# EAGLE design S7G2_Titan_Teknic_motor_sim (EAGLE 9.6.2)
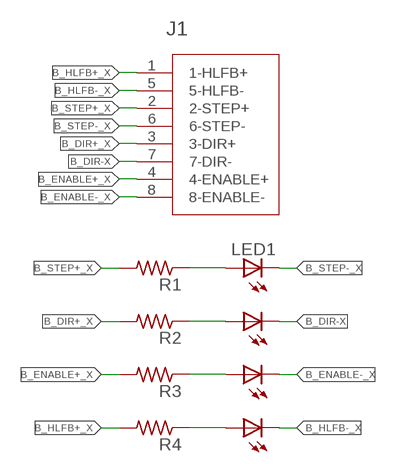
[diagram p0: schematic, sheet 1]

## Parts
J1  TEKNIC_MOTOR_SD_8PIN  [CON_39281083]
LED1  Green  LED_0805_GREEN  [0805]
LED2  Green  LED_0805_GREEN  [0805]
LED3  Green  LED_0805_GREEN  [0805]
LED4  Green  LED_0805_GREEN  [0805]
R1  R_0805  [0805]
R2  R_0805  [0805]
R3  R_0805  [0805]
R4  R_0805  [0805]

## Nets
B_DIR+_X: J1.3(3-DIR+) R2.2
B_DIR-X: J1.7(7-DIR-) LED2.2(C)
B_ENABLE+_X: J1.4(4-ENABLE+) R3.2
B_ENABLE-_X: J1.8(8-ENABLE-) LED3.2(C)
B_HLFB+_X: J1.1(1-HLFB+) R4.2
B_HLFB-_X: J1.5(5-HLFB-) LED4.2(C)
B_STEP+_X: J1.2(2-STEP+) R1.2
B_STEP-_X: J1.6(6-STEP-) LED1.2(C)
N$1: LED1.1(A) R1.1
N$2: LED2.1(A) R2.1
N$3: LED3.1(A) R3.1
N$4: LED4.1(A) R4.1

## Library data of the parts
J1 = 3D_MIG_Controller:TEKNIC_MOTOR_SD_8PIN; COPYRIGHT: Copyright (C) 2022 Ultra Librarian. All rights reserved.; MANUFACTURER_PART_NUMBER: 39281083; MFR_NAME: Molex Connector Corporation
LED1-LED4 = 3D_MIG_Controller:LED_0805_GREEN: Green 570nm LED Indication - Discrete 2.2V 0805 (2012 Metric); PARTNO: LG R971-KN-1
R1-R4 = 3D_MIG_Controller:R_0805

## Board
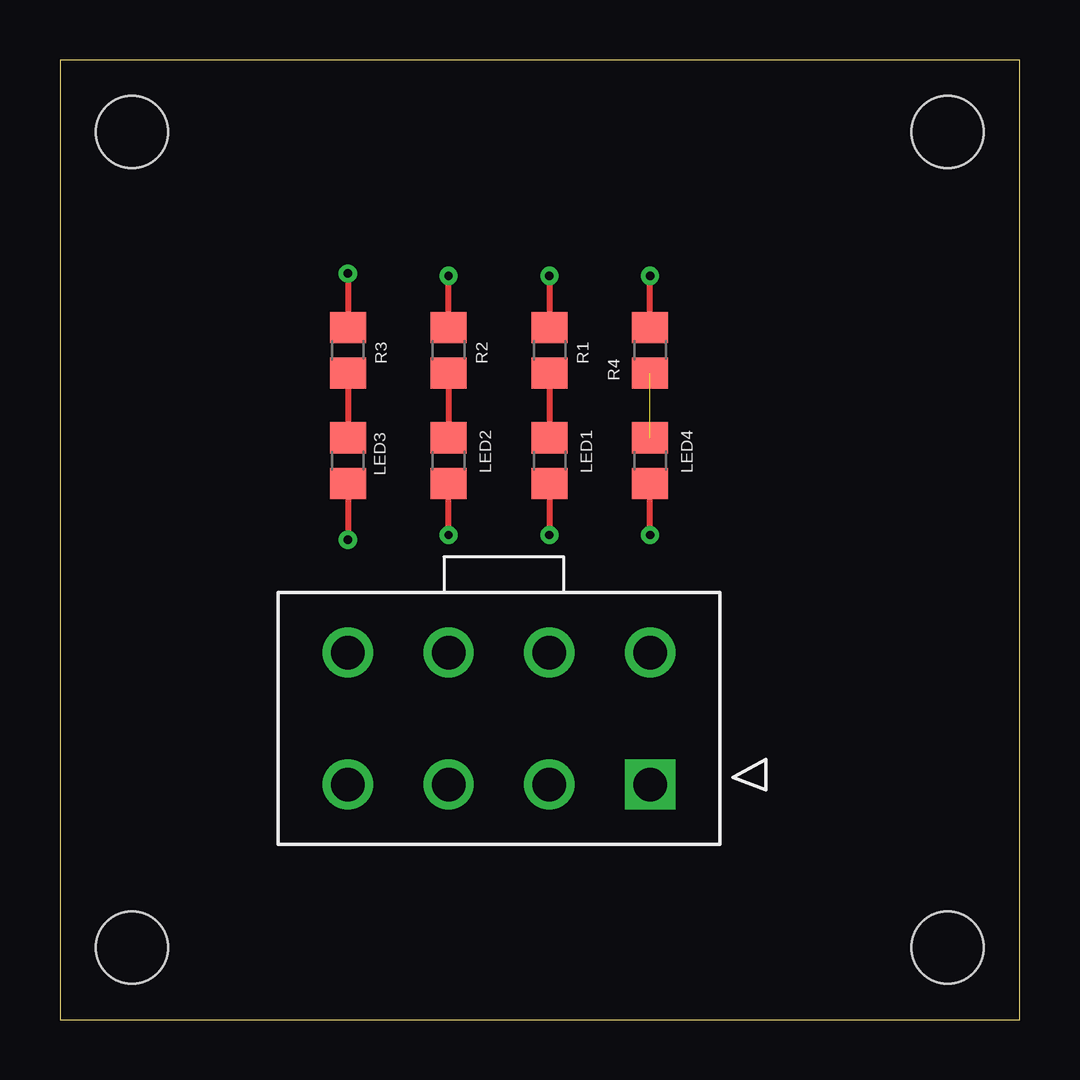
[diagram p1: board, top side]
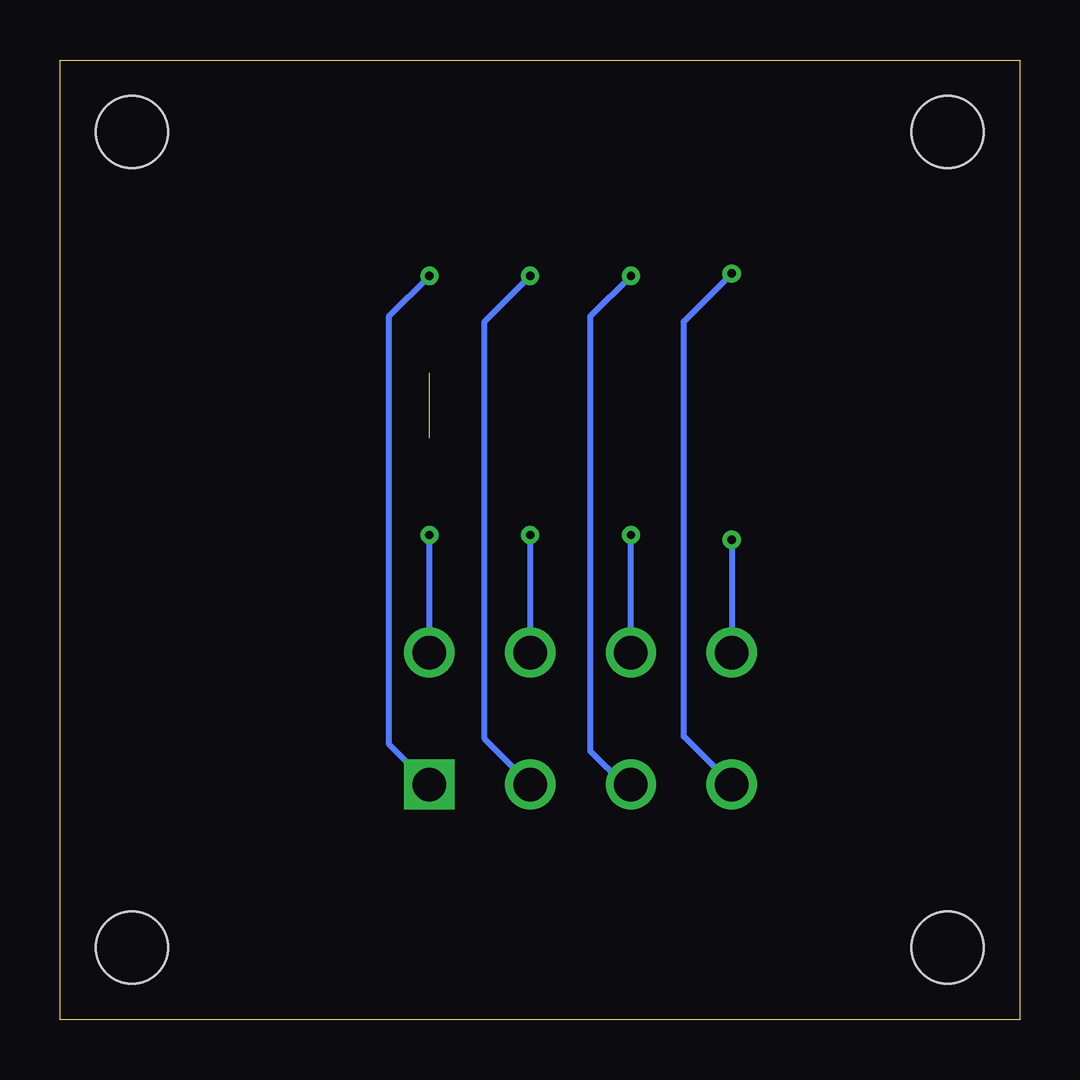
[diagram p2: board, bottom side, seen from below]

Size 40 x 40 mm. Coordinates in mm from the lower left corner, seen from the top.
Outline: 0,0 40,0 40,40 0,40 0,0
Copper layers (1*16): Top 0.035mm / dielectric 1.5mm / Bottom 0.035mm
Design rules "default": minimum track width 6mil, minimum drill 0.35mm, track to track 6mil, track to pad 6mil, pad to pad 6mil, via to via 6mil, smd to smd 6mil, copper to edge 40mil, drill to drill 6mil, minimum pad ring 10mil, minimum via ring 8mil, stop-mask expansion 4mil, vias tented up to drill 0mil, thermal gap 10mil
Holes 3 mm at 3,3 37,3 3,37 37,37

### Footprints (pad centres in the part's own frame; a part is rotated, then mirrored left to right if it is on the bottom)
CON_39281083 = drill 1.397 pad 1.905 square: 1 12.6,-5.5 | drill 1.397 pad 1.905: 2 8.4,-5.5; 3 4.2,-5.5; 4 0,-5.5; 5 12.6,0; 6 8.4,0; 7 4.2,0; 8 0,0
0805 = smd 1.3 x 1.5: 1 -0.95,0; 2 0.95,0

### Placement (x,y rotation side)
J1  12,15.3 0 top
LED1  20.41,23.3 270 top
LED2  16.2,23.3 270 top
LED3  12,23.3 270 top
LED4  24.6,23.3 270 top
R1  20.41,27.9 90 top
R2  16.2,27.9 90 top
R3  12,27.9 90 top
R4  24.6,27.9 90 top

### Tracks (layer width: path | path; a pad name or v marks a point on that pad's centre or on a via)
B_DIR+_X  (via drill 0.35)
  Top 0.254: R2.2 v16.2,31
  Bottom 0.254: v16.2,31 17.9,29.3 17.9,11.2 16.5,9.8 J1.3
B_DIR-X  (via drill 0.35)
  Top 0.254: v16.2,20.2 LED2.2
  Bottom 0.254: J1.7 v16.2,20.2
B_ENABLE+_X  (via drill 0.35)
  Top 0.254: v12,31.1 R3.2
  Bottom 0.254: J1.4 14,11.8 14,29.1 v12,31.1
B_ENABLE-_X  (via drill 0.35)
  Top 0.254: LED3.2 v12,20
  Bottom 0.254: v12,20 J1.8
B_HLFB+_X  (via drill 0.35)
  Top 0.254: R4.2 v24.6,31
  Bottom 0.254: v24.6,31 26.3,29.3 26.3,11.5 J1.1
B_HLFB-_X  (via drill 0.35)
  Top 0.254: v24.6,20.2 LED4.2
  Bottom 0.254: J1.5 v24.6,20.2
B_STEP+_X  (via drill 0.35)
  Top 0.254: v20.4,31 v20.41,30.99 R1.2
  Bottom 0.254: J1.2 22.3,11.7 22.3,29.1 v20.4,31
B_STEP-_X  (via drill 0.35)
  Top 0.254: LED1.2 v20.41,20.21 v20.4,20.2
  Bottom 0.254: v20.4,20.2 J1.6
N$1
  Top 0.254: R1.1 LED1.1
N$2
  Top 0.254: R2.1 LED2.1
N$3
  Top 0.254: R3.1 LED3.1
N$4  (1 unrouted)